# Altium schematic sheet RJ45-2.SchDoc
size A4
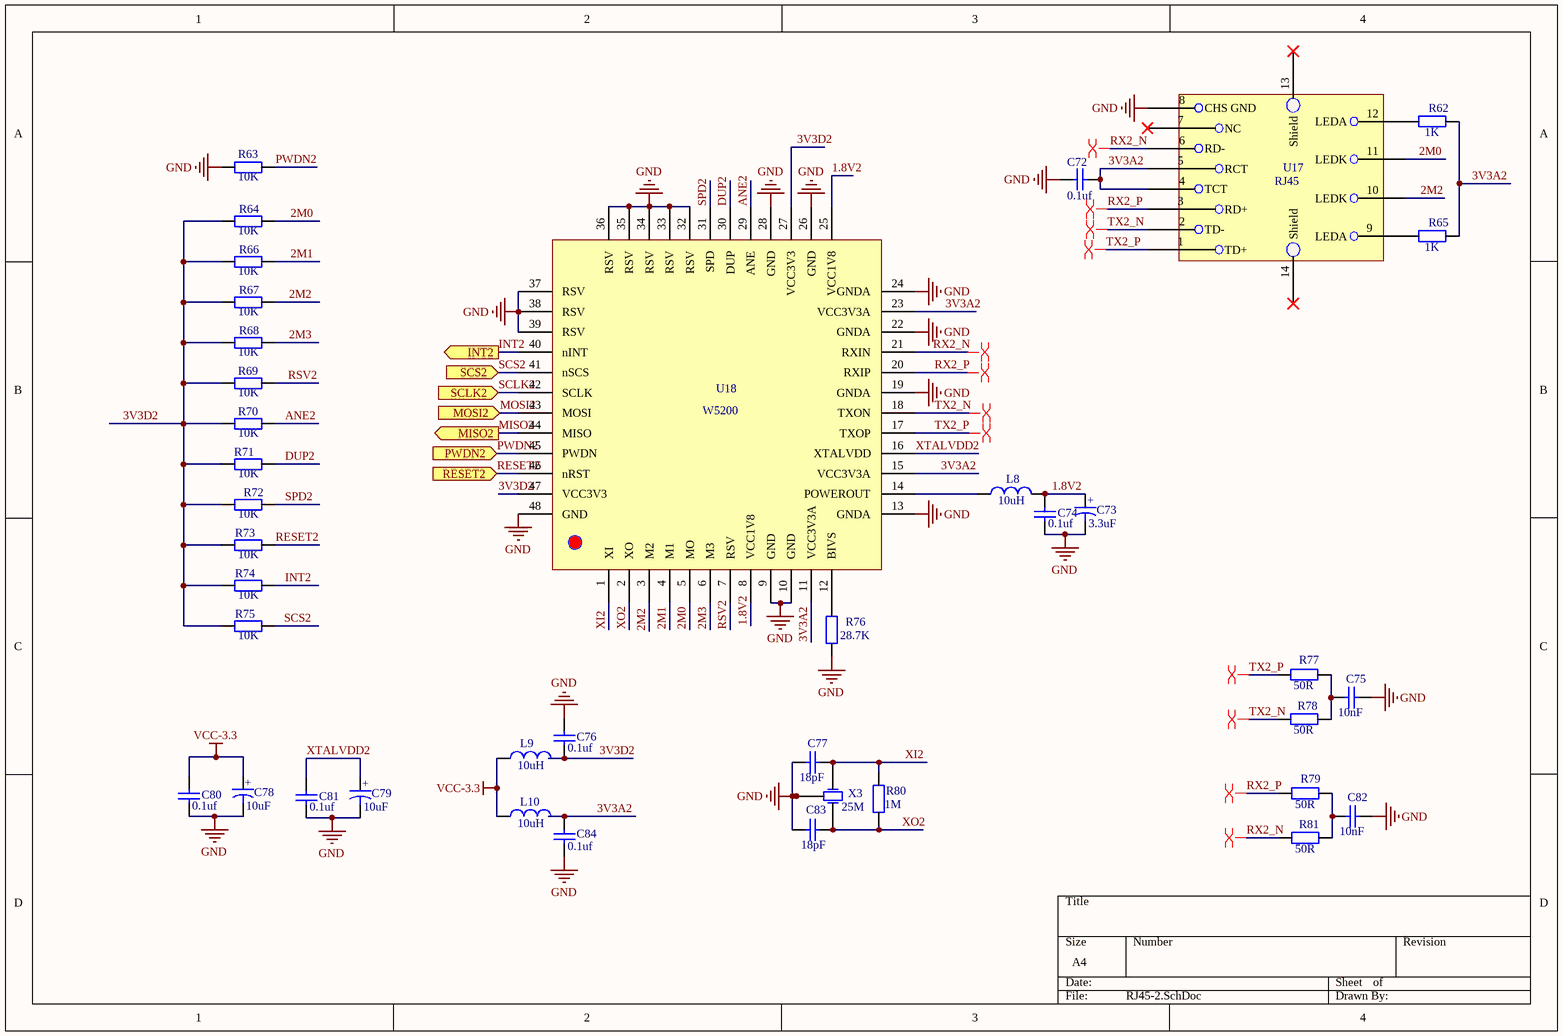
[diagram p0: RJ45-2.SchDoc]

## Parts
C72  value 0.1uf  [0603]  (hidden comment: Capacitor-0603)
C73  value 3.3uF  [钽电容1206（A3216）]  (hidden comment: 电解电容)
C74  value 0.1uf  [0603]  (hidden comment: Capacitor-0603)
C75  value 10nF  [0603]  (hidden comment: Capacitor-0603)
C76  value 0.1uf  [0603]  (hidden comment: Capacitor-0603)
C77  value 18pF  [0603]  (hidden comment: Capacitor-0603)
C78  value 10uF  [钽电容1206（A3216）]  (hidden comment: 电解电容)
C79  value 10uF  [钽电容1206（A3216）]  (hidden comment: 电解电容)
C80  value 0.1uf  [0603]  (hidden comment: Capacitor-0603)
C81  value 0.1uf  [0603]  (hidden comment: Capacitor-0603)
C82  value 10nF  [0603]  (hidden comment: Capacitor-0603)
C83  value 18pF  [0603]  (hidden comment: Capacitor-0603)
C84  value 0.1uf  [0603]  (hidden comment: Capacitor-0603)
L8  value 10uH  [0805]  (hidden comment: Inductor)
L9  value 10uH  [0805]  (hidden comment: Inductor)
L10  value 10uH  [0805]  (hidden comment: Inductor)
R62  value 1K  [0603]  (hidden comment: Resistor-0603)
R63  value 10K  [0603]  (hidden comment: Resistor-0603)
R64  value 10K  [0603]  (hidden comment: Resistor-0603)
R65  value 1K  [0603]  (hidden comment: Resistor-0603)
R66  value 10K  [0603]  (hidden comment: Resistor-0603)
R67  value 10K  [0603]  (hidden comment: Resistor-0603)
R68  value 10K  [0603]  (hidden comment: Resistor-0603)
R69  value 10K  [0603]  (hidden comment: Resistor-0603)
R70  value 10K  [0603]  (hidden comment: Resistor-0603)
R71  value 10K  [0603]  (hidden comment: Resistor-0603)
R72  value 10K  [0603]  (hidden comment: Resistor-0603)
R73  value 10K  [0603]  (hidden comment: Resistor-0603)
R74  value 10K  [0603]  (hidden comment: Resistor-0603)
R75  value 10K  [0603]  (hidden comment: Resistor-0603)
R76  value 28.7K  [0603]  (hidden comment: Resistor-0603)
R77  value 50R  [0603]  (hidden comment: Resistor-0603)
R78  value 50R  [0603]  (hidden comment: Resistor-0603)
R79  value 50R  [0603]  (hidden comment: Resistor-0603)
R80  value 1M  [0603]  (hidden comment: Resistor-0603)
R81  value 50R  [0603]  (hidden comment: Resistor-0603)
U17  RJ45  [RJ45]
U18  Name: W5200  [W5200-Chip]  (hidden comment: W5200-Chip)
X3  value 25M  [3225无源晶振]  (hidden comment: 3225无源晶振)

## Ports
INT2 (out), MISO2 (out), MOSI2 (in), PWDN2 (in), RESET2 (in), SCLK2 (in), SCS2 (in)

## Nets
GND: C72.2 C73.1 C74.1 C75.2 C76.2 C77.1 C78.1 C79.1 C80.1 C81.1 C82.2 C83.1 C84.2 R63.1 R76.1 U17.8(CHS_GND) U18.9(GND) U18.10(GND) U18.13(GNDA) U18.19(GNDA) U18.22(GNDA) U18.24(GNDA) U18.26(GND) U18.28(GND) U18.32(RSV) U18.33(RSV) U18.34(RSV) U18.35(RSV) U18.36(RSV) U18.37(RSV) U18.38(RSV) U18.39(RSV) U18.48(GND) X3.2(GND) X3.4(GND)
VCC-3.3: C78.2 C80.2 L9.1 L10.1
1.8V2: C73.2 C74.2 L8.2 U18.8(VCC1V8) U18.25(VCC1V8)
2M0: R64.2 U17.11(LEDK) U18.5(MO)
2M1: R66.2 U18.4(M1)
2M2: R67.2 U17.10(LEDK) U18.3(M2)
2M3: R68.2 U18.6(M3)
3V3A2: C72.1 C84.1 L10.2 R62.2 R65.2 U17.4(TCT) U17.5(RCT) U18.11(VCC3V3A) U18.15(VCC3V3A) U18.23(VCC3V3A)
3V3D2: C76.1 L9.2 R64.1 R66.1 R67.1 R68.1 R69.1 R70.1 R71.1 R72.1 R73.1 R74.1 R75.1 U18.27(VCC3V3) U18.47(VCC3V3)
ANE2: R70.2 U18.29(ANE)
DUP2: R71.2 U18.30(DUP)
INT2: R74.2 U18.40(nINT) ; port INT2
MISO2: U18.44(MISO) ; port MISO2
MOSI2: U18.43(MOSI) ; port MOSI2
PWDN2: R63.2 U18.45(PWDN) ; port PWDN2
RESET2: R73.2 U18.46(nRST) ; port RESET2
RSV2: R69.2 U18.7(RSV)
RX2_N: R81.1 U17.6(RD-) U18.21(RXIN)
RX2_P: R79.1 U17.3(RD+) U18.20(RXIP)
SCLK2: U18.42(SCLK) ; port SCLK2
SCS2: R75.2 U18.41(nSCS) ; port SCS2
SPD2: R72.2 U18.31(SPD)
TX2_N: R78.1 U17.2(TD-) U18.18(TXON)
TX2_P: R77.1 U17.1(TD+) U18.17(TXOP)
XI2: C77.2 R80.1 U18.1(XI) X3.1(OSC1)
XO2: C83.2 R80.2 U18.2(XO) X3.3(OSC2)
XTALVDD2: C79.2 C81.2 U18.16(XTALVDD)
NetC75_1: C75.1 R77.2 R78.2
NetC82_1: C82.1 R79.2 R81.2
NetL8_1: L8.1 U18.14(POWEROUT)
NetR62_1: R62.1 U17.12(LEDA)
NetR65_1: R65.1 U17.9(LEDA)
NetR76_2: R76.2 U18.12(BIVS)

Not connected (* = marked no-connect by the designer): U17 7(NC)* 13(Shield)* 14(Shield)*

## Layout directives
differential pair: RX2_N, RX2_P, TX2_N, TX2_P

## Notes on the sheet
- (in symbol 电解电容) +

## Library data of the parts
U17 = RJ45: Name: RJ45